# Altium schematic sheet MainSCH.SchDoc
size A2
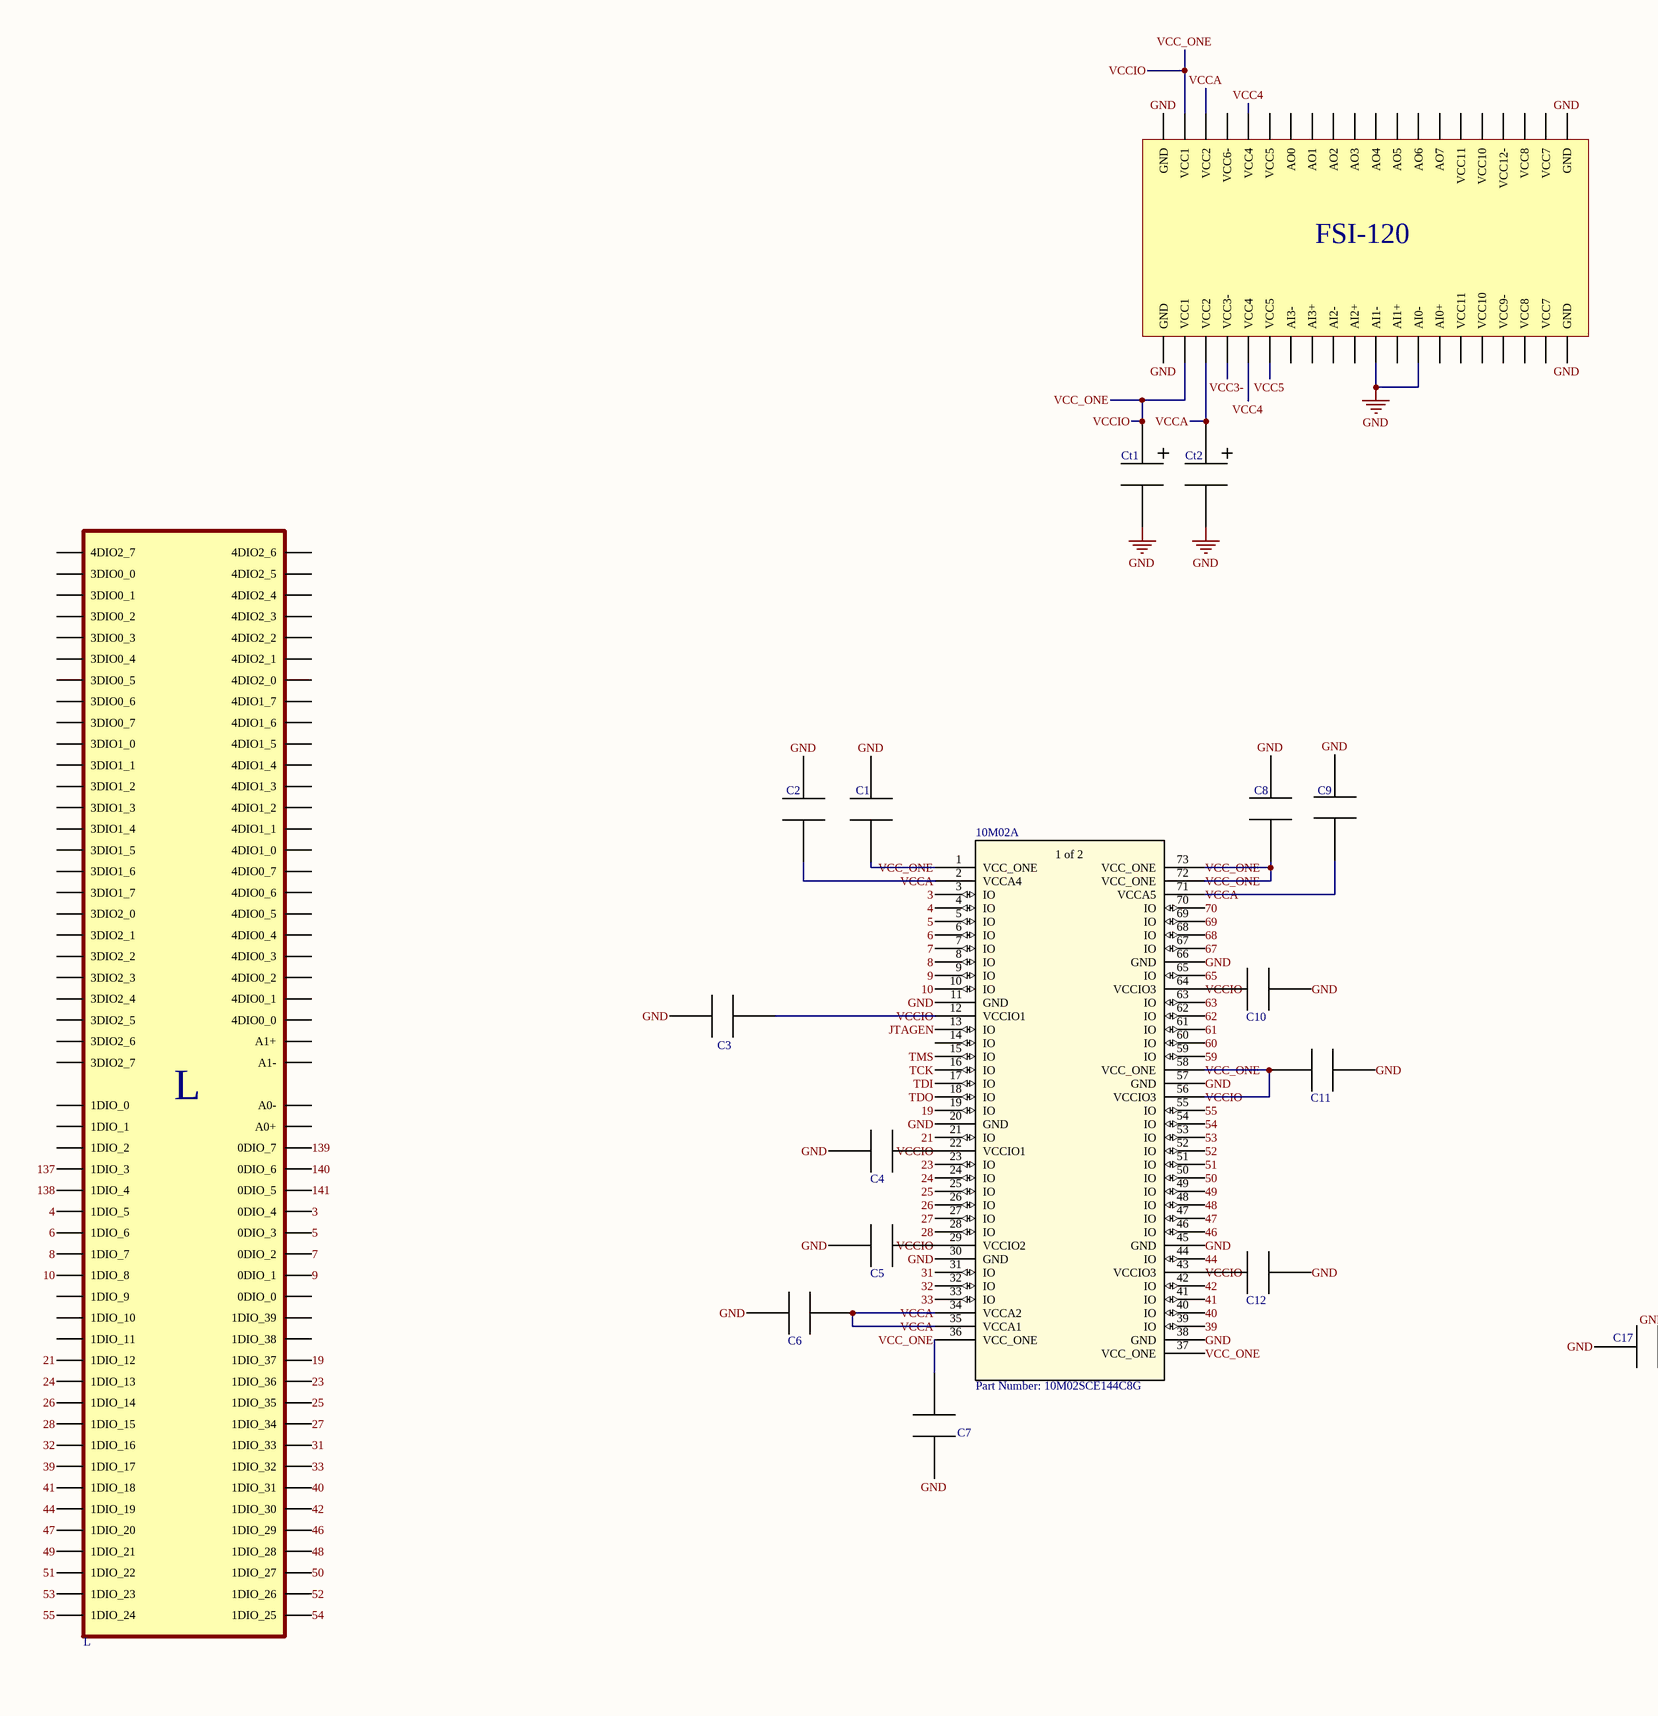
[diagram p0: MainSCH.SchDoc, left]
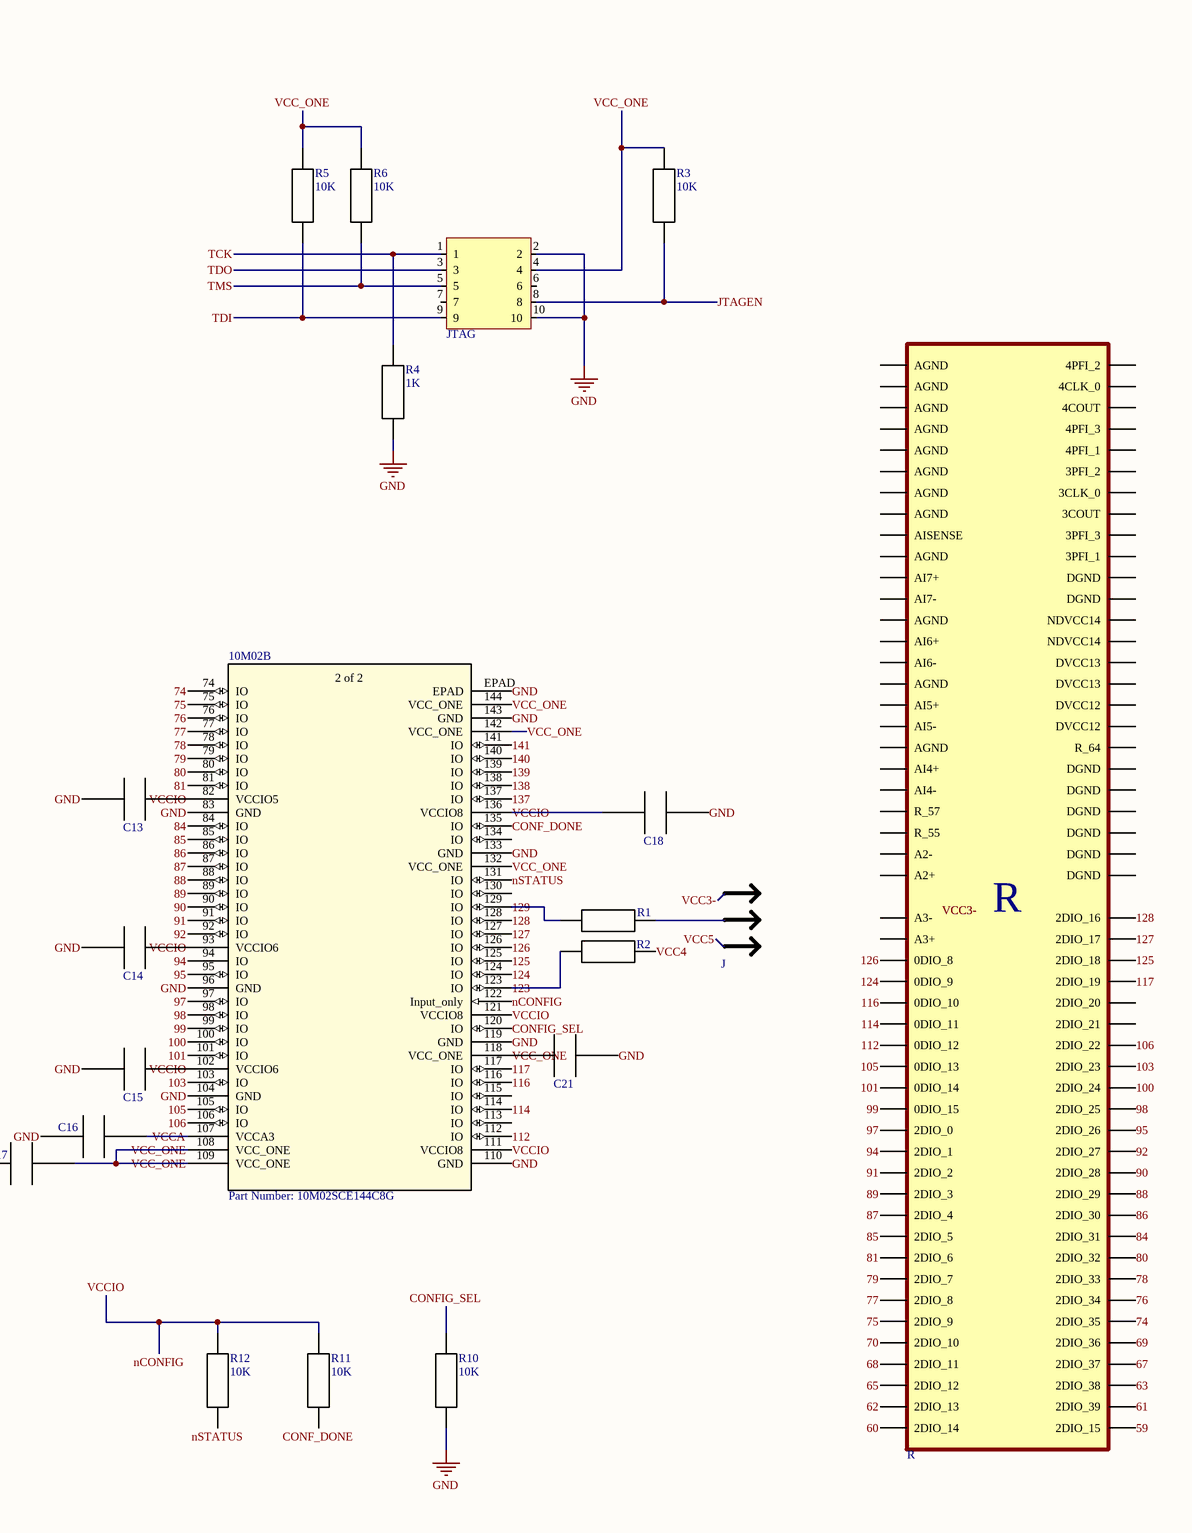
[diagram p1: MainSCH.SchDoc, right]

## Parts
10M02  Part Number: 10M02SCE144C8G  [EQFP-144_A:1P65_]  (parts A,B of 2)
*  JTAG  [JTAG]
C1  *  [0805]  (value not drawn)
C2  *  [0805]  (value not drawn)
C3  *  [0805]  (value not drawn)
C4  *  [0805]  (value not drawn)
C5  *  [0805]  (value not drawn)
C6  *  [0805]  (value not drawn)
C7  *  [0805]  (value not drawn)
C8  *  [0805]  (value not drawn)
C9  *  [0805]  (value not drawn)
C10  *  [0805]  (value not drawn)
C11  *  [0805]  (value not drawn)
C12  *  [0805]  (value not drawn)
C13  *  [0805]  (value not drawn)
C14  *  [0805]  (value not drawn)
C15  *  [0805]  (value not drawn)
C16  *  [0805]  (value not drawn)
C17  *  [0805]  (value not drawn)
C18  *  [0805]  (value not drawn)
C21  *  [0805]  (value not drawn)
Ct1  C_Ta  [C_Ta]  (value not drawn)
Ct2  C_Ta  [C_Ta]  (value not drawn)
J  JUMPER_SWITCH_2S  [JUMPER_SWITCH_2S]  (value not drawn)
L  FSI-150-L  [FSI-150]  (value not drawn)
R  FSI-150-R  [FSI-150]  (value not drawn)
R1  *  [0805]  (value not drawn)
R2  *  [0805]  (value not drawn)
R3  10K  [0805]
R4  1K  [0805]
R5  10K  [0805]
R6  10K  [0805]
R10  10K  [0805]
R11  10K  [0805]
R12  10K  [0805]
X  FSI120  [FSI-120]  (value not drawn)

## Nets
GND: 10M02.11(GND) 10M02.20(GND) 10M02.30(GND) 10M02.38(GND) 10M02.45(GND) 10M02.57(GND) 10M02.66(GND) 10M02.83(GND) 10M02.96(GND) 10M02.104(GND) 10M02.110(GND) 10M02.119(GND) 10M02.133(GND) 10M02.143(GND) 10M02.EPAD *.2 *.10 C1.2 C2.2 C3.2 C4.2 C5.2 C6.1 C7.1 C8.2 C9.2 C10.2 C11.2 C12.2 C13.1 C14.1 C15.2 C16.2 C17.2 C18.2 C21.2 Ct1.2 Ct2.2 R4.1 R10.1 X.1(GND) X.8(AI0-) X.10(AI1-) X.20(GND) X.21(GND) X.40(GND)
3: 10M02.3(IO) L.R_40(0DIO_4)
4: 10M02.4(IO) L.R_39(1DIO_5)
5: 10M02.5(IO) L.R_38(0DIO_3)
6: 10M02.6(IO) L.R_37(1DIO_6)
7: 10M02.7(IO) L.R_36(0DIO_2)
8: 10M02.8(IO) L.R_35(1DIO_7)
9: 10M02.9(IO) L.R_34(0DIO_1)
10: 10M02.10(IO) L.R_33(1DIO_8)
19: 10M02.19(IO) L.R_26(1DIO_37)
21: 10M02.21(IO) L.R_25(1DIO_12)
23: 10M02.23(IO) L.R_24(1DIO_36)
24: 10M02.24(IO) L.R_23(1DIO_13)
25: 10M02.25(IO) L.R_22(1DIO_35)
26: 10M02.26(IO) L.R_21(1DIO_14)
27: 10M02.27(IO) L.R_20(1DIO_34)
28: 10M02.28(IO) L.R_19(1DIO_15)
31: 10M02.31(IO) L.R_18(1DIO_33)
32: 10M02.32(IO) L.R_17(1DIO_16)
33: 10M02.33(IO) L.R_16(1DIO_32)
39: 10M02.39(IO) L.R_15(1DIO_17)
40: 10M02.40(IO) L.R_14(1DIO_31)
41: 10M02.41(IO) L.R_13(1DIO_18)
42: 10M02.42(IO) L.R_12(1DIO_30)
44: 10M02.44(IO) L.R_11(1DIO_19)
46: 10M02.46(IO) L.R_10(1DIO_29)
47: 10M02.47(IO) L.R_9(1DIO_20)
48: 10M02.48(IO) L.R_8(1DIO_28)
49: 10M02.49(IO) L.R_7(1DIO_21)
50: 10M02.50(IO) L.R_6(1DIO_27)
51: 10M02.51(IO) L.R_5(1DIO_22)
52: 10M02.52(IO) L.R_4(1DIO_26)
53: 10M02.53(IO) L.R_3(1DIO_23)
54: 10M02.54(IO) L.R_2(1DIO_25)
55: 10M02.55(IO) L.R_1(1DIO_24)
59: 10M02.59(IO) R.R_2(2DIO_15)
60: 10M02.60(IO) R.R_1(2DIO_14)
61: 10M02.61(IO) R.R_4(2DIO_39)
62: 10M02.62(IO) R.R_3(2DIO_13)
63: 10M02.63(IO) R.R_6(2DIO_38)
65: 10M02.65(IO) R.R_5(2DIO_12)
67: 10M02.67(IO) R.R_8(2DIO_37)
68: 10M02.68(IO) R.R_7(2DIO_11)
69: 10M02.69(IO) R.R_10(2DIO_36)
70: 10M02.70(IO) R.R_9(2DIO_10)
74: 10M02.74(IO) R.R_12(2DIO_35)
75: 10M02.75(IO) R.R_11(2DIO_9)
76: 10M02.76(IO) R.R_14(2DIO_34)
77: 10M02.77(IO) R.R_13(2DIO_8)
78: 10M02.78(IO) R.R_16(2DIO_33)
79: 10M02.79(IO) R.R_15(2DIO_7)
80: 10M02.80(IO) R.R_18(2DIO_32)
81: 10M02.81(IO) R.R_17(2DIO_6)
84: 10M02.84(IO) R.R_20(2DIO_31)
85: 10M02.85(IO) R.R_19(2DIO_5)
86: 10M02.86(IO) R.R_22(2DIO_30)
87: 10M02.87(IO) R.R_21(2DIO_4)
88: 10M02.88(IO) R.R_24(2DIO_29)
89: 10M02.89(IO) R.R_23(2DIO_3)
90: 10M02.90(IO) R.R_26(2DIO_28)
91: 10M02.91(IO) R.R_25(2DIO_2)
92: 10M02.92(IO) R.R_28(2DIO_27)
94: 10M02.94(IO) R.R_27(2DIO_1)
95: 10M02.95(IO) R.R_30(2DIO_26)
97: 10M02.97(IO) R.R_29(2DIO_0)
98: 10M02.98(IO) R.R_32(2DIO_25)
99: 10M02.99(IO) R.R_31(0DIO_15)
100: 10M02.100(IO) R.R_34(2DIO_24)
101: 10M02.101(IO) R.R_33(0DIO_14)
103: 10M02.103(IO) R.R_36(2DIO_23)
105: 10M02.105(IO) R.R_35(0DIO_13)
106: 10M02.106(IO) R.R_38(2DIO_22)
112: 10M02.112(IO) R.R_37(0DIO_12)
114: 10M02.114(IO) R.R_39(0DIO_11)
116: 10M02.116(IO) R.R_41(0DIO_10)
117: 10M02.117(IO) R.R_44(2DIO_19)
123: 10M02.123(IO) R2.1
124: 10M02.124(IO) R.R_43(0DIO_9)
125: 10M02.125(IO) R.R_46(2DIO_18)
126: 10M02.126(IO) R.R_45(0DIO_8)
127: 10M02.127(IO) R.R_48(2DIO_17)
128: 10M02.128(IO) R.R_50(2DIO_16)
129: 10M02.129(IO) R1.1
137: 10M02.137(IO) L.R_43(1DIO_3)
138: 10M02.138(IO) L.R_41(1DIO_4)
139: 10M02.139(IO) L.R_46(0DIO_7)
140: 10M02.140(IO) L.R_44(0DIO_6)
141: 10M02.141(IO) L.R_42(0DIO_5)
CONF_DONE: 10M02.135(IO) R11.1
CONFIG_SEL: 10M02.120(IO) R10.2
JTAGEN: 10M02.13(IO) *.8 R3.1
nCONFIG: 10M02.1(VCC_ONE) 10M02.12(VCCIO1) 10M02.22(VCCIO1) 10M02.29(VCCIO2) 10M02.36(VCC_ONE) 10M02.37(VCC_ONE) 10M02.43(VCCIO3) 10M02.56(VCCIO3) 10M02.58(VCC_ONE) 10M02.64(VCCIO3) 10M02.72(VCC_ONE) 10M02.73(VCC_ONE) 10M02.82(VCCIO5) 10M02.93(VCCIO6) 10M02.102(VCCIO6) 10M02.108(VCC_ONE) 10M02.109(VCC_ONE) 10M02.111(VCCIO8) 10M02.118(VCC_ONE) 10M02.121(VCCIO8) 10M02.122(Input_only) 10M02.132(VCC_ONE) 10M02.136(VCCIO8) 10M02.142(VCC_ONE) 10M02.144(VCC_ONE) *.4 C1.1 C3.1 C4.1 C5.1 C7.2 C8.1 C10.1 C11.1 C12.1 C13.2 C14.2 C15.1 C17.1 C18.1 C21.1 Ct1.1 R3.2 R5.2 R6.2 R11.2 R12.2 X.19(VCC1) X.22(VCC1)  [also labelled VCC_ONE, VCCIO]
nSTATUS: 10M02.131(IO) R12.1
TCK: 10M02.16(IO) *.1 R4.2
TDI: 10M02.17(IO) *.9 R5.1
TDO: 10M02.18(IO) *.3
TMS: 10M02.15(IO) *.5 R6.1
VCC3-: J.1 X.17(VCC3-)
VCC4: R2.2 X.16(VCC4) X.25(VCC4)
VCC5: J.2 X.15(VCC5)
VCCA: 10M02.2(VCCA4) 10M02.34(VCCA2) 10M02.35(VCCA1) 10M02.71(VCCA5) 10M02.107(VCCA3) C2.1 C6.2 C9.1 C16.1 Ct2.1 X.18(VCC2) X.23(VCC2)
NetJ_0: J.0 R1.2

Not connected (* = marked no-connect by the designer): 10M02 14(IO) 113(IO) 115(IO) 130(IO) 134(IO); * 6 7; L R_27(1DIO_11) R_28(1DIO_38) R_29(1DIO_10) R_30(1DIO_39) R_31(1DIO_9) R_32(0DIO_0) R_45(1DIO_2) R_47(1DIO_1) R_48(A0+) R_49(1DIO_0) R_50(A0-) R_51(3DIO2_7) R_52(A1-) R_53(3DIO2_6) R_54(A1+) R_55(3DIO2_5) R_56(4DIO0_0) R_57(3DIO2_4) R_58(4DIO0_1) R_59(3DIO2_3) R_60(4DIO0_2) R_61(3DIO2_2) R_62(4DIO0_3) R_63(3DIO2_1) R_64(4DIO0_4) R_65(3DIO2_0) R_66(4DIO0_5) R_67(3DIO1_7) R_68(4DIO0_6) R_69(3DIO1_6) R_70(4DIO0_7) R_71(3DIO1_5) R_72(4DIO1_0) R_73(3DIO1_4) R_74(4DIO1_1) R_75(3DIO1_3) R_76(4DIO1_2) R_77(3DIO1_2) R_78(4DIO1_3) R_79(3DIO1_1) R_80(4DIO1_4) R_81(3DIO1_0) R_82(4DIO1_5) R_83(3DIO0_7) R_84(4DIO1_6) R_85(3DIO0_6) R_86(4DIO1_7) R_87(3DIO0_5) R_88(4DIO2_0) R_89(3DIO0_4) R_90(4DIO2_1) R_91(3DIO0_3) R_92(4DIO2_2) R_93(3DIO0_2) R_94(4DIO2_3) R_95(3DIO0_1) R_96(4DIO2_4) R_97(3DIO0_0) R_98(4DIO2_5) R_99(4DIO2_7) R_100(4DIO2_6); R R_40(2DIO_21) R_42(2DIO_20) R_47(A3+) R_49(A3-) R_51(A2+) R_52(DGND) R_53(A2-) R_54(DGND) R_55 R_56(DGND) R_57 R_58(DGND) R_59(AI4-) R_60(DGND) R_61(AI4+) R_62(DGND) R_63(AGND) R_64 R_65(AI5-) R_66(DVCC12) R_67(AI5+) R_68(DVCC12) R_69(AGND) R_70(DVCC13) R_71(AI6-) R_72(DVCC13) R_73(AI6+) R_74(NDVCC14) R_75(AGND) R_76(NDVCC14) R_77(AI7-) R_78(DGND) R_79(AI7+) R_80(DGND) R_81(AGND) R_82(3PFI_1) R_83(AISENSE) R_84(3PFI_3) R_85(AGND) R_86(3COUT) R_87(AGND) R_88(3CLK_0) R_89(AGND) R_90(3PFI_2) R_91(AGND) R_92(4PFI_1) R_93(AGND) R_94(4PFI_3) R_95(AGND) R_96(4COUT) R_97(AGND) R_98(4CLK_0) R_99(AGND) R_100(4PFI_2); X 2(VCC7) 3(VCC8) 4(VCC9-) 5(VCC10) 6(VCC11) 7(AI0+) 9(AI1+) 11(AI2+) 12(AI2-) 13(AI3+) 14(AI3-) 24(VCC6-) 26(VCC5) 27(AO0) 28(AO1) 29(AO2) 30(AO3) 31(AO4) 32(AO5) 33(AO6) 34(AO7) 35(VCC11) 36(VCC10) 37(VCC7) 38(VCC8) 39(VCC12-)

## Notes on the sheet
- (in symbol 10M02SCE144C8G, part A) 1 of 2
- (in symbol 10M02SCE144C8G, part B) 2 of 2
- (in symbol FSI120) FSI-120

## Library data of the parts
10M02 = 10M02SCE144C8G: No Description Available; Vendor: Intel; Built_By: EMA_Cory; Manufacturer_Part_Number: 10M02SCE144C8G; Copyright: Copyright (C) 2018 Accelerated Designs. All rights reserved; RefDes: RefDes; Type: DEV; Value: Value
C1-C18 C21 = C0805: 0805 ceramic capacitor; Capacity: *
Ct1 Ct2 = C_Ta: tantalum capacitor
J = JUMPER_SWITCH_2S: 2 state jumper switch
L = FSI-150-L: fsi 150 left
R = FSI-150-R: fsi 150 right
R1-R6 R10-R12 = R0805: 0805 resistor; Resistance: *